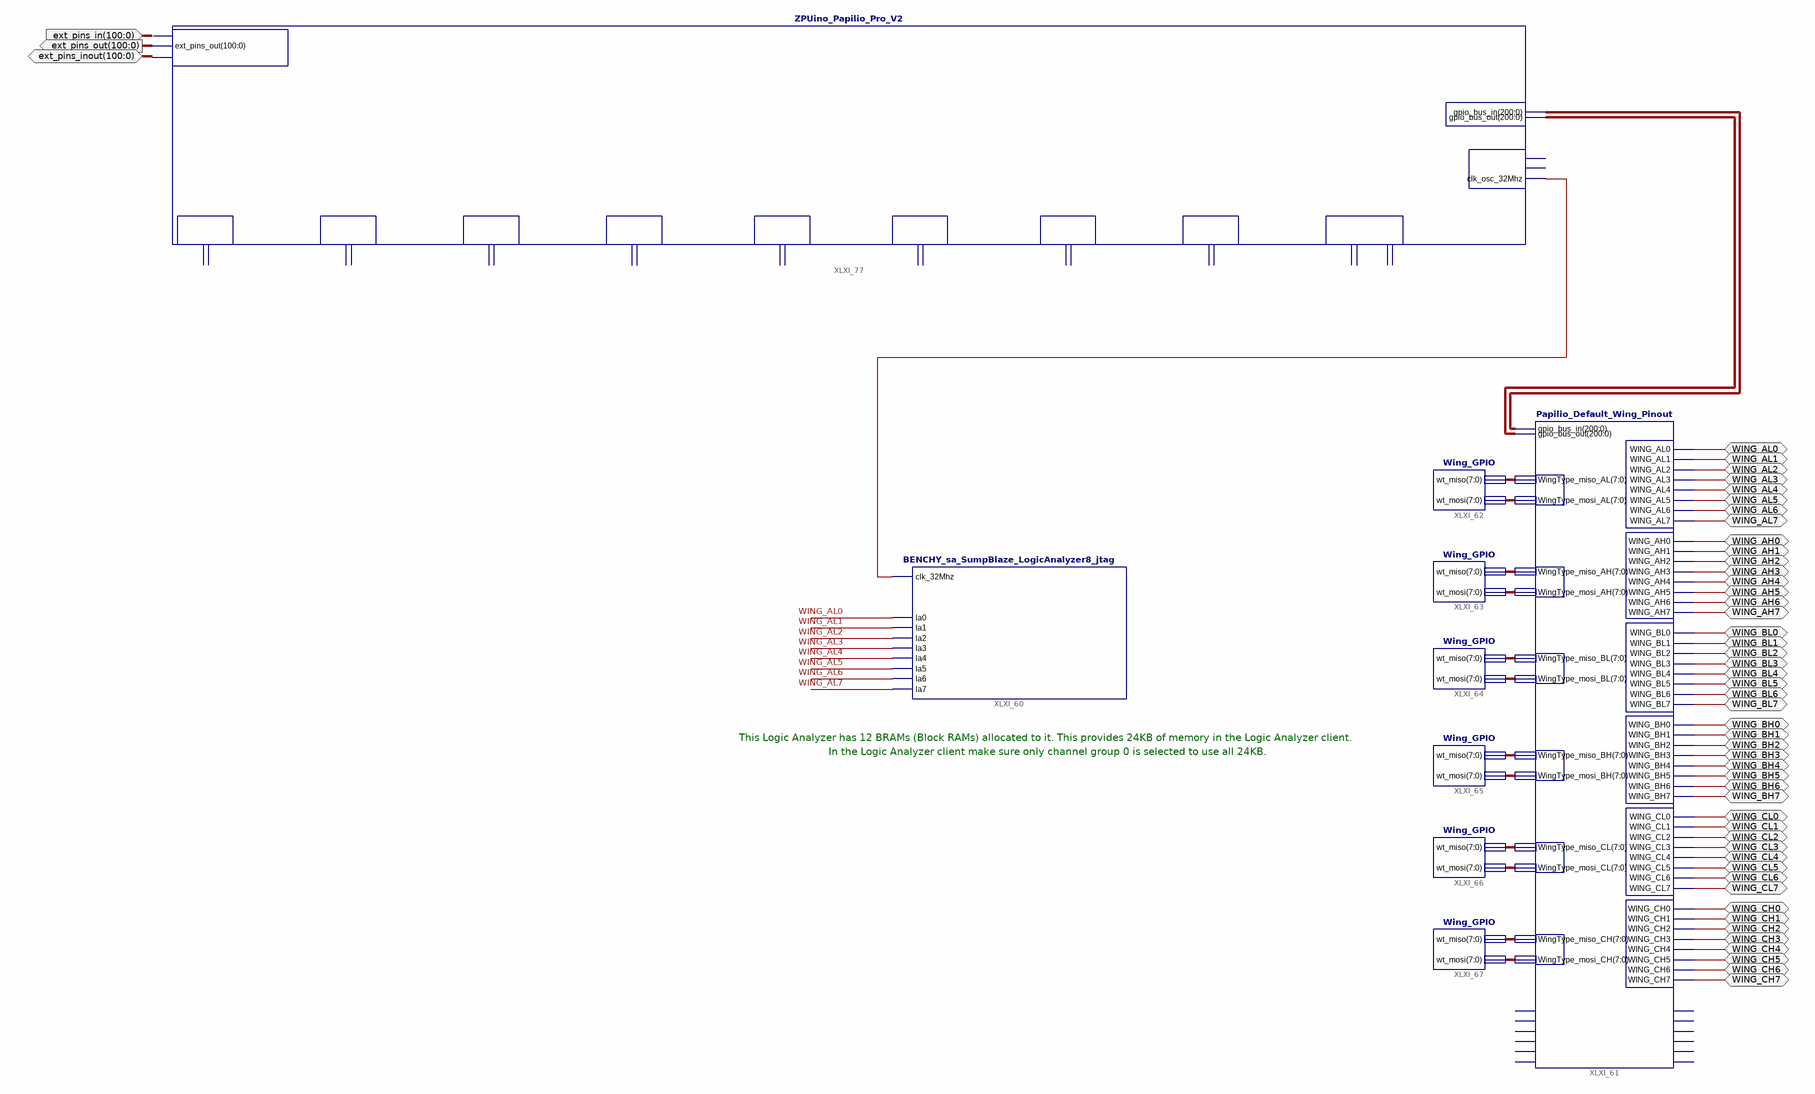
[diagram p0: schematic sheet 1]
// Xilinx ISE schematic Papilio_Pro.sch (spartan6) as structural Verilog: 9 symbols, 51 ports
module Papilio_Pro (
  input  [100:0] ext_pins_in,
  inout  WING_AL0,
  inout  WING_AL1,
  inout  WING_AL2,
  inout  WING_AL3,
  inout  WING_AL4,
  inout  WING_AL5,
  inout  WING_AL6,
  inout  WING_AL7,
  inout  WING_AH0,
  inout  WING_AH1,
  inout  WING_AH2,
  inout  WING_AH3,
  inout  WING_AH4,
  inout  WING_AH5,
  inout  WING_AH6,
  inout  WING_AH7,
  inout  WING_BL0,
  inout  WING_BL1,
  inout  WING_BL2,
  inout  WING_BL3,
  inout  WING_BL4,
  inout  WING_BL5,
  inout  WING_BL6,
  inout  WING_BL7,
  inout  WING_BH0,
  inout  WING_BH1,
  inout  WING_BH2,
  inout  WING_BH3,
  inout  WING_BH4,
  inout  WING_BH5,
  inout  WING_BH6,
  inout  WING_BH7,
  inout  WING_CL0,
  inout  WING_CL1,
  inout  WING_CL2,
  inout  WING_CL3,
  inout  WING_CL4,
  inout  WING_CL5,
  inout  WING_CL6,
  inout  WING_CL7,
  inout  WING_CH0,
  inout  WING_CH1,
  inout  WING_CH2,
  inout  WING_CH3,
  inout  WING_CH4,
  inout  WING_CH5,
  inout  WING_CH6,
  inout  WING_CH7,
  inout  [100:0] ext_pins_inout,
  output [100:0] ext_pins_out
);

  wire XLXN_520;
  wire [7:0] XLXN_521, XLXN_522, XLXN_523, XLXN_524, XLXN_525, XLXN_526, XLXN_527, XLXN_528, XLXN_529,
       XLXN_530, XLXN_531, XLXN_532;
  wire [200:0] XLXN_408, XLXN_409;

  BENCHY_sa_SumpBlaze_LogicAnalyzer8_jtag #(.brams(12)) XLXI_60 (
    .clk_32Mhz(XLXN_520), .la0(WING_AL0), .la1(WING_AL1), .la2(WING_AL2), .la3(WING_AL3), .la4(WING_AL4),
    .la5(WING_AL5), .la6(WING_AL6), .la7(WING_AL7));
  Papilio_Default_Wing_Pinout XLXI_61 (
    .WING_AH0(WING_AH0), .WING_AH1(WING_AH1), .WING_AH2(WING_AH2), .WING_AH3(WING_AH3), .WING_AH4(WING_AH4),
    .WING_AH5(WING_AH5), .WING_AH6(WING_AH6), .WING_AH7(WING_AH7), .WING_AL0(WING_AL0), .WING_AL1(WING_AL1),
    .WING_AL2(WING_AL2), .WING_AL3(WING_AL3), .WING_AL4(WING_AL4), .WING_AL5(WING_AL5), .WING_AL6(WING_AL6),
    .WING_AL7(WING_AL7), .WING_BH0(WING_BH0), .WING_BH1(WING_BH1), .WING_BH2(WING_BH2), .WING_BH3(WING_BH3),
    .WING_BH4(WING_BH4), .WING_BH5(WING_BH5), .WING_BH6(WING_BH6), .WING_BH7(WING_BH7), .WING_BL0(WING_BL0),
    .WING_BL1(WING_BL1), .WING_BL2(WING_BL2), .WING_BL3(WING_BL3), .WING_BL4(WING_BL4), .WING_BL5(WING_BL5),
    .WING_BL6(WING_BL6), .WING_BL7(WING_BL7), .WING_CL0(WING_CL0), .WING_CL1(WING_CL1), .WING_CL2(WING_CL2),
    .WING_CL3(WING_CL3), .WING_CL4(WING_CL4), .WING_CL5(WING_CL5), .WING_CL6(WING_CL6), .WING_CL7(WING_CL7),
    .WING_CH0(WING_CH0), .WING_CH1(WING_CH1), .WING_CH2(WING_CH2), .WING_CH3(WING_CH3), .WING_CH4(WING_CH4),
    .WING_CH5(WING_CH5), .WING_CH6(WING_CH6), .WING_CH7(WING_CH7), .gpio_bus_out(XLXN_408),
    .gpio_bus_in(XLXN_409), .WingType_miso_BH(XLXN_527), .WingType_miso_BL(XLXN_525),
    .WingType_miso_AH(XLXN_523), .WingType_mosi_BL(XLXN_526), .WingType_mosi_BH(XLXN_528),
    .WingType_mosi_CL(XLXN_530), .WingType_mosi_AH(XLXN_524), .WingType_miso_CL(XLXN_529),
    .WingType_miso_CH(XLXN_531), .WingType_mosi_CH(XLXN_532), .WingType_mosi_AL(XLXN_522),
    .WingType_miso_AL(XLXN_521));  // open: Flex_Pin_out_0, Flex_Pin_out_1, Flex_Pin_out_2, Flex_Pin_out_3, Flex_Pin_out_4, Flex_Pin_out_5, Flex_Pin_in_0, Flex_Pin_in_1, Flex_Pin_in_2, Flex_Pin_in_3, Flex_Pin_in_4, Flex_Pin_in_5
  Wing_GPIO XLXI_62 (.wt_miso(XLXN_521), .wt_mosi(XLXN_522));
  Wing_GPIO XLXI_63 (.wt_miso(XLXN_523), .wt_mosi(XLXN_524));
  Wing_GPIO XLXI_64 (.wt_miso(XLXN_525), .wt_mosi(XLXN_526));
  Wing_GPIO XLXI_65 (.wt_miso(XLXN_527), .wt_mosi(XLXN_528));
  Wing_GPIO XLXI_66 (.wt_miso(XLXN_529), .wt_mosi(XLXN_530));
  Wing_GPIO XLXI_67 (.wt_miso(XLXN_531), .wt_mosi(XLXN_532));
  ZPUino_Papilio_Pro_V2 XLXI_77 (
    .gpio_bus_out(XLXN_408), .gpio_bus_in(XLXN_409), .clk_osc_32Mhz(XLXN_520), .ext_pins_in(ext_pins_in),
    .ext_pins_out(ext_pins_out), .ext_pins_inout(ext_pins_inout));  // open: clk_96Mhz, clk_1Mhz, wishbone_slot_5_out, wishbone_slot_5_in, wishbone_slot_6_in, wishbone_slot_6_out, wishbone_slot_8_in, wishbone_slot_8_out, wishbone_slot_9_in, wishbone_slot_9_out, wishbone_slot_10_in, wishbone_slot_10_out, wishbone_slot_11_in, wishbone_slot_11_out, wishbone_slot_12_in, wishbone_slot_12_out, wishbone_slot_13_in, wishbone_slot_13_out, wishbone_slot_14_in, wishbone_slot_14_out, wishbone_slot_video_in, wishbone_slot_video_out

  // Notes on the sheet:
  //   This Logic Analyzer has 12 BRAMs (Block RAMs) allocated to it. This provides 24KB of memory in the Logic Analyzer client.
  //   In the Logic Analyzer client make sure only channel group 0 is selected to use all 24KB.
endmodule
